# Altium project OVP.PrjPCB
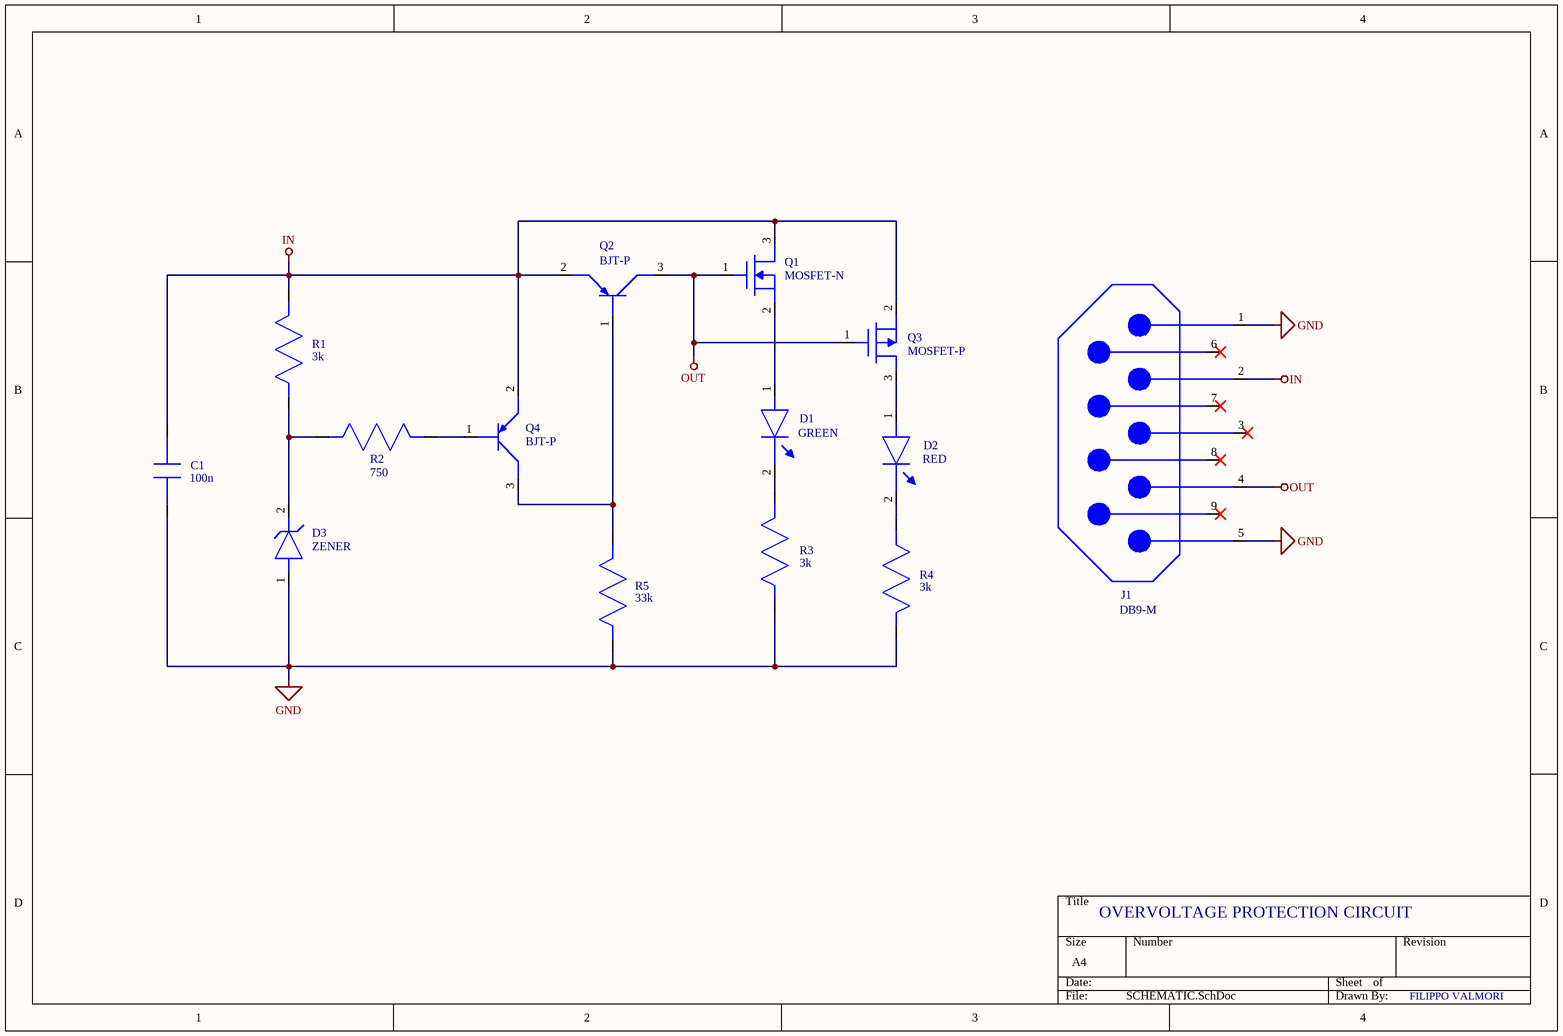
[diagram p0: SCHEMATIC.SchDoc]
1 sheet, 14 parts. Net scope: global (net labels, ports and power ports of the same name join across sheets).
Board file: PCB.PcbDoc

## Sheet SCHEMATIC.SchDoc
size A4

### Parts
C1  100n  [CAP-0603]
D1  GREEN  [LED-0603]
D2  RED  [LED-0603]
D3  ZENER  [ZENER-SOD523]
J1  DB9-M  [DB9]
Q1  MOSFET-N  [NMOS-SOT23]
Q2  BJT-P  [BJT-SOT23]
Q3  MOSFET-P  [PMOS-SOT23]
Q4  BJT-P  [BJT-SOT23]
R1  3k  [RES-0805]
R2  750  [RES-0805]
R3  3k  [RES-0805]
R4  3k  [RES-0805]
R5  33k  [RES-0805]

### Nets
GND: C1.2 D3.1 J1.1 J1.5 R3.1 R4.2 R5.1
IN: C1.1 J1.2 Q1.3 Q2.2 Q3.2 Q4.2 R1.2
OUT: J1.4 Q1.1 Q2.3 Q3.1
NetD1_1: D1.1 Q1.2
NetD1_2: D1.2 R3.2
NetD2_1: D2.1 Q3.3
NetD2_2: D2.2 R4.1
NetD3_2: D3.2 R1.1 R2.1
NetQ2_1: Q2.1 Q4.3 R5.2
NetQ4_1: Q4.1 R2.2

Not connected (* = marked no-connect by the designer): J1 3* 6* 7* 8* 9*

### Notes on the sheet
- OVERVOLTAGE PROTECTION CIRCUIT
- FILIPPO VALMORI

### Library data of the parts
C1 = C0603C104M3RACTU: Multilayer Ceramic Capacitors MLCC - SMD/SMT 25volts 0.1uF X7R 20%; Manufacturer: KEMET; Capacitance: 100nF; Voltage Rating: 25V; Supplier 1: Digi-Key; Manufacturer Part Number: C0603C104M3RACTU; Stock 1: 15620; Pricing 1: 1=0.1, 10=0.06, 100=0.0267, 500=0.01906, 1000=0.01497 (USD); Mount: Surface Mount,PCB; Case/Package: 0603; Number of Pins: 2; Case Code (Metric): 1608; Case Code (Imperial): 0603; Dielectric Material: Ceramic; Min Operating Temperature: -55°C; Max Operating Temperature: 125°C; Packaging: Tape and Reel; Tolerance: 20%; Package Quantity: 1; Voltage Rating (DC): 25V; Dielectric: X7R; Termination: SMD/SMT; Length: 1.6mm; Height: 0.8mm; Width: 0.031inch; Thickness: 0.034inch; Lead Pitch: 0.7mm; Depth: 0.8mm; Radiation Hardening: No; REACH SVHC: No SVHC; ComponentLink1URL: https://www.verical.com/server-webapp/html/getDatasheet?partID=58462&src-supplier=Verical; ComponentLink1Description: https://www.verical.com/server-webapp/html/getDatasheet?partID=58462&src-supplier=Verical; ComponentLink2URL: http://www.farnell.com/datasheets/2746054.pdf?src-supplier=Newark; ComponentLink2Description: http://www.farnell.com/datasheets/2746054.pdf?src-supplier=Newark; ComponentLink3URL: https://www.verical.com/server-webapp/html/getDatasheet?partID=344365&src-supplier=Verical; ComponentLink3Description: https://www.verical.com/server-webapp/html/getDatasheet?partID=344365&src-supplier=Verical; ComponentLink4URL: http://www.alliedelec.com/m/d/9bfe7773041ffe9d406e68bc7b377fdd.pdf?src-supplier=Allied+Electronics; ComponentLink4Description: http://www.alliedelec.com/m/d/9bfe7773041ffe9d406e68bc7b377fdd.pdf?src-supplier=Allied+Electronics; Supplier Part Number 1: 399-1283-6-ND; Category: Capacitors
D1 = 598-8070-107F: DIALIGHT - 5988070107F - LED, Green, SMD, 0603, 20 mA, 2 V, 570 nm; Lens Color: Colorless,Clear; Forward Voltage: 2V; Forward Current: 20mA; Wavelength: 570nm; Luminous Intensity: 20mcd; Viewing Angle: 140°; Lens Style: Flat,Rectangular,Diffused,Colorless,Clear; Dominant Wavelength: 568nm; Number of Elements: 1; Power Dissipation: 60mW; Reverse Voltage: 5V; Lens Transparency: Clear; Lens Size: 0.8mm; Supplier 1: Digi-Key; Manufacturer: Dialight; Manufacturer Part Number: 598-8070-107F; Stock 1: 4673; Pricing 1: 1=0.42, 10=0.3, 100=0.1333, 500=0.09332, 1000=0.07666 (USD); Mount: Surface Mount; Case/Package: 0603; Number of Pins: 2; Color: Green; Case Code (Metric): 1608; Case Code (Imperial): 0603; Min Operating Temperature: -30°C; Max Operating Temperature: 100°C; Package Quantity: 4000; Packaging: Tape and Reel; Illumination Color: Green; Test Current: 20mA; Number of LEDs: 1; Length: 1.6mm; Height: 0.7mm; Depth: 0.8mm; Width: 0.8mm; Radiation Hardening: No; Lead Free: Lead Free; REACH SVHC: No SVHC; ComponentLink1URL: http://www.mouser.com/ds/2/109/SMT_selector_guide-267443.pdf?src-supplier=Mouser; ComponentLink1Description: http://www.mouser.com/ds/2/109/SMT_selector_guide-267443.pdf?src-supplier=Mouser; ComponentLink2URL: http://uk.rs-online.com/webdocs/0ae2/0900766b80ae2975.pdf?src-supplier=RSComponents; ComponentLink2Description: http://uk.rs-online.com/webdocs/0ae2/0900766b80ae2975.pdf?src-supplier=RSComponents; ComponentLink3URL: http://www.farnell.com/datasheets/1720200.pdf?src-supplier=Element14; ComponentLink3Description: http://www.farnell.com/datasheets/1720200.pdf?src-supplier=Element14; ComponentLink4URL: https://media.digikey.com/pdf/Data%20Sheets/Dialight%20PDFs/598_Series_0603_Pkg.pdf?src-supplier=Digi-Key; ComponentLink4Description: https://media.digikey.com/pdf/Data%20Sheets/Dialight%20PDFs/598_Series_0603_Pkg.pdf?src-supplier=Digi-Key; ComponentLink5URL: https://www.alliedelec.com/m/d/745256ca487aea7b70ea31e2d673d5bb.pdf?src-supplier=Allied+Electronics; ComponentLink5Description: https://www.alliedelec.com/m/d/745256ca487aea7b70ea31e2d673d5bb.pdf?src-supplier=Allied+Electronics; ComponentLink6URL: http://www.onlinecomponents.com/productFiles/mf-DIA/mdei5980603.pdf?src-supplier=Onlinecomponents.com; ComponentLink6Description: http://www.onlinecomponents.com/productFiles/mf-DIA/mdei5980603.pdf?src-supplier=Onlinecomponents.com; ComponentLink7URL: https://www.verical.com/server-webapp/html/getDatasheet?partID=146438&src-supplier=Verical; ComponentLink7Description: https://www.verical.com/server-webapp/html/getDatasheet?partID=146438&src-supplier=Verical; ComponentLink8URL: http://www.dialight.com/Assets/Brochures_And_Catalogs/Indication/SMT_selector_guide.pdf?src-supplier=Future+Electronics; ComponentLink8Description: http://www.dialight.com/Assets/Brochures_And_Catalogs/Indication/SMT_selector_guide.pdf?src-supplier=Future+Electronics; Category: Diodes; Supplier Part Number 1: 350-2035-6-ND
D2 = 598-8020-107F: DIALIGHT   5988020107F   LED, RED ORANGE, 150MCD, 630NM; Color: Red,Orange; Lens Color: Colorless,Clear; Forward Current: 20mA; Forward Voltage: 2V; Viewing Angle: 140°; Lens Style: Flat,Diffused,Colorless,Rectangular,Clear; Dominant Wavelength: 625nm; Number of Elements: 1; Power Dissipation: 55mW; Reverse Voltage: 5V; Lens Transparency: Clear; Lens Size: 0.8mm; Supplier 1: Digi-Key; Manufacturer: Dialight; Manufacturer Part Number: 598-8020-107F; Stock 1: 14692; Pricing 1: 1=0.47, 10=0.336, 100=0.1495, 500=0.10464, 1000=0.08595 (USD); Mount: Surface Mount; Case/Package: 0603; Number of Pins: 2; Case Code (Metric): 1608; Case Code (Imperial): 0603; Min Operating Temperature: -30°C; Max Operating Temperature: 100°C; Package Quantity: 4000; Packaging: Tape and Reel; Wavelength: 630nm; Luminous Intensity: 150mcd; Illumination Color: Orange; Test Current: 20mA; Number of LEDs: 1; Length: 1.6mm; Height: 0.7mm; Depth: 0.8mm; Width: 0.8mm; Radiation Hardening: No; Lead Free: Lead Free; REACH SVHC: No SVHC; ComponentLink1URL: https://www.alliedelec.com/m/d/67ce6cfd66c5ca65d1535dac34303b05.pdf?src-supplier=Allied+Electronics; ComponentLink1Description: https://www.alliedelec.com/m/d/67ce6cfd66c5ca65d1535dac34303b05.pdf?src-supplier=Allied+Electronics; ComponentLink2URL: http://www.onlinecomponents.com/productFiles/mf-DIA/mdei5980603.pdf?src-supplier=Onlinecomponents.com; ComponentLink2Description: http://www.onlinecomponents.com/productFiles/mf-DIA/mdei5980603.pdf?src-supplier=Onlinecomponents.com; ComponentLink3URL: https://media.digikey.com/pdf/Data%20Sheets/Dialight%20PDFs/598_Series_0603_Pkg.pdf?src-supplier=Digi-Key; ComponentLink3Description: https://media.digikey.com/pdf/Data%20Sheets/Dialight%20PDFs/598_Series_0603_Pkg.pdf?src-supplier=Digi-Key; ComponentLink4URL: https://www.verical.com/server-webapp/html/getDatasheet?partID=187920&src-supplier=Verical; ComponentLink4Description: https://www.verical.com/server-webapp/html/getDatasheet?partID=187920&src-supplier=Verical; ComponentLink5URL: http://www.farnell.com/datasheets/25658.pdf?src-supplier=Element14; ComponentLink5Description: http://www.farnell.com/datasheets/25658.pdf?src-supplier=Element14; ComponentLink6URL: http://www.dialight.com/Assets/Brochures_And_Catalogs/Indication/SMT_selector_guide.pdf?src-supplier=Future+Electronics; ComponentLink6Description: http://www.dialight.com/Assets/Brochures_And_Catalogs/Indication/SMT_selector_guide.pdf?src-supplier=Future+Electronics; Category: Diodes; Supplier Part Number 1: 350-2030-6-ND
D3 = BZT585B10T-7: DIODE ZENER 10V 350MW SOD523; Manufacturer: Diodes; Impedance: 10R; Tolerance: 2%; Element Configuration: Single; Zener Current: 5mA; Peak Reverse Current: 200nA; Forward Voltage: 900mV; ESD Protection: No; Supplier 1: Digi-Key; Manufacturer Part Number: BZT585B10T-7; Stock 1: 3462; Pricing 1: 1=0.22, 10=0.177, 25=0.148, 100=0.0724, 250=0.07128, 500=0.0604, 1000=0.04197 (USD); Mount: Surface Mount; Case/Package: SOD-523-2; Number of Pins: 2; Weight: 3.5E-05oz; Contact Plating: Tin,Matte; Min Operating Temperature: -65°C; Max Operating Temperature: 150°C; Packaging: Tape and Reel; Zener Voltage: 10V; Max Power Dissipation: 350mW; Voltage Tolerance: 2%; Package Quantity: 3000; Max Reverse Leakage Current: 200nA; Test Current: 5mA; ComponentLink1URL: http://www.mouser.com/ds/2/115/BZT585BxVxT-318149.pdf?src-supplier=Mouser; ComponentLink1Description: http://www.mouser.com/ds/2/115/BZT585BxVxT-318149.pdf?src-supplier=Mouser; ComponentLink2URL: http://diodes.com/datasheets/BZT585BxVxT.pdf?src-supplier=Avnet; ComponentLink2Description: http://diodes.com/datasheets/BZT585BxVxT.pdf?src-supplier=Avnet; ComponentLink3URL: https://www.diodes.com/assets/Datasheets/BZT585BxVxT.pdf?src-supplier=Digi-Key; ComponentLink3Description: https://www.diodes.com/assets/Datasheets/BZT585BxVxT.pdf?src-supplier=Digi-Key; Supplier Part Number 1: BZT585B10T-7DIDKR-ND; Category: Diodes
J1 = 09661227801: D-Sub Standard Connectors DSUB SV ML SSDP ANG73-254 09P AU3; Manufacturer: HARTING Technology; Connector Type: D-Sub,Plug,Signal; Number of Positions: 9; Number of Ports: 1; Current Rating: 7.5A; Supplier 1: Digi-Key; Manufacturer Part Number: 09661227801; Stock 1: 102; Pricing 1: 1=4.15, 10=3.984, 25=3.652, 50=3.486, 100=3.32, 250=2.905, 500=2.822, 1000=2.407 (USD); Mount: Through Hole; Number of Terminals: 9; Housing Material: Polybutylene; Contact Material: Copper Alloy; Min Operating Temperature: -55°C; Max Operating Temperature: 125°C; Package Quantity: 100; Packaging: Bulk; Number of Rows: 2; Termination: Solder; Orientation: Right Angle; Length: 30.9mm; Flammability Rating: UL94 V-0; ComponentLink1URL: https://b2b.harting.com/files/download/PRD/PDF_TS/0966122X80X_BL01_R29733_100202197DRW002A.PDF?src-supplier=Digi-Key; ComponentLink1Description: https://b2b.harting.com/files/download/PRD/PDF_TS/0966122X80X_BL01_R29733_100202197DRW002A.PDF?src-supplier=Digi-Key; Supplier Part Number 1: 1195-4989-ND; Category: Connectors
Q1 = 2N7002LT1G: Trans MOSFET N-CH 60V 0.115A 3-Pin SOT-23 T/R; Manufacturer: ON Semiconductor; Continuous Drain Current (ID): 115mA; Turn-Off Delay Time: 40ns; Turn-On Delay Time: 20ns; Gate to Source Voltage (Vgs): 20V; Rds On Max: 7.5R; Input Capacitance: 50pF; Nominal Vgs: 2.5V; Number of Elements: 1; Max Power Dissipation: 225mW; Power Dissipation: 300mW; Element Configuration: Single; Supplier 1: Digi-Key; Manufacturer Part Number: 2N7002LT1G; Stock 1: 1300580; Pricing 1: 1=0.18, 10=0.164, 25=0.1564, 100=0.0688, 250=0.066, 500=0.054, 1000=0.0375 (USD); Case/Package: SOT-23-3; Number of Pins: 3; Contact Plating: Tin,Matte; Min Operating Temperature: -55°C; Max Operating Temperature: 150°C; Package Quantity: 1; Packaging: Tape and Reel; Drain to Source Voltage (Vdss): 60V; Drain to Source Breakdown Voltage: 60V; Drain to Source Resistance: 7.5R; Threshold Voltage: 2.5V; Voltage Rating (DC): 60V; Current Rating: 115mA; On-State Resistance: 7.5R; Number of Channels: 1; Length: 3.04mm; Height: 1.01mm; Width: 1.4mm; Radiation Hardening: No; REACH SVHC: No SVHC; Lead Free: Lead Free; Halogen Free: Halogen Free; ComponentLink1URL: http://www.onsemi.com/pub/Collateral/2N7002L-D.PDF?src-supplier=Digi-Key; ComponentLink1Description: http://www.onsemi.com/pub/Collateral/2N7002L-D.PDF?src-supplier=Digi-Key; ComponentLink2URL: http://www.farnell.com/datasheets/1747988.pdf?src-supplier=Element14; ComponentLink2Description: http://www.farnell.com/datasheets/1747988.pdf?src-supplier=Element14; ComponentLink3URL: http://www.farnell.com/datasheets/1747988.pdf?src-supplier=Newark; ComponentLink3Description: http://www.farnell.com/datasheets/1747988.pdf?src-supplier=Newark; ComponentLink4URL: http://www.farnell.com/datasheets/2354034.pdf?src-supplier=Element14; ComponentLink4Description: http://www.farnell.com/datasheets/2354034.pdf?src-supplier=Element14; ComponentLink5URL: http://www.onsemi.com/pub_link/Collateral/2N7002L-D.PDF?src-supplier=Future+Electronics; ComponentLink5Description: http://www.onsemi.com/pub_link/Collateral/2N7002L-D.PDF?src-supplier=Future+Electronics; ComponentLink6URL: http://www.onsemi.com/pub/Collateral/2N7002L-D.PDF?src-supplier=Avnet; ComponentLink6Description: http://www.onsemi.com/pub/Collateral/2N7002L-D.PDF?src-supplier=Avnet; ComponentLink7URL: http://www.onsemi.com/pub/Collateral/2N7002L-D.PDF?src-supplier=Avnet+Europe; ComponentLink7Description: http://www.onsemi.com/pub/Collateral/2N7002L-D.PDF?src-supplier=Avnet+Europe; ComponentLink8URL: http://www.onsemi.com/pub/Collateral/2N7002L-D.PDF?src-supplier=Avnet+Asia; ComponentLink8Description: http://www.onsemi.com/pub/Collateral/2N7002L-D.PDF?src-supplier=Avnet+Asia; Category: Transistors; Supplier Part Number 1: 2N7002LT1GOSDKR-ND
Q2 Q4 = MMBT2907ALT1G: MMBT2907AL Series 60 V 600 mA SMT PNP General Purpose Transistor - SOT-23; Manufacturer: ON Semiconductor; Max Power Dissipation: 300mW; Number of Elements: 1; Frequency: 200MHz; Collector Emitter Voltage (VCEO): 60V; hFE Min: 75; Max Collector Current: 600mA; Collector Emitter Breakdown Voltage: -60V; Emitter Base Voltage (VEBO): 5V; Collector Emitter Saturation Voltage: -1.6V; Element Configuration: Single; Current Rating: -600mA; Supplier 1: Digi-Key; Manufacturer Part Number: MMBT2907ALT1G; Stock 1: 211221; Pricing 1: 1=0.15, 10=0.134, 25=0.1276, 100=0.0561, 250=0.05384, 500=0.04406, 1000=0.0306 (USD); Case/Package: SOT-23-3; Number of Pins: 3; Contact Plating: Tin,Matte; Min Operating Temperature: -55°C; Max Operating Temperature: 150°C; Package Quantity: 3000; Packaging: Tape and Reel; Transition Frequency: 200MHz; Max Breakdown Voltage: 60V; Polarity: PNP; Collector Base Voltage (VCBO): 60V; Power Dissipation: 300mW; Gain Bandwidth Product: 200MHz; Max Frequency: 200MHz; Voltage Rating (DC): -60V; Type: General Purpose; Length: 2.9mm; Height: 0.94mm; Width: 1.3mm; Radiation Hardening: No; Lead Free: Lead Free; REACH SVHC: No SVHC; ComponentLink1URL: http://www.onsemi.com/pub/Collateral/MMBT2907ALT1-D.PDF?src-supplier=Digi-Key; ComponentLink1Description: http://www.onsemi.com/pub/Collateral/MMBT2907ALT1-D.PDF?src-supplier=Digi-Key; ComponentLink2URL: https://www.alliedelec.com/m/d/f1da87220e07dfe91b55a9a93f81e6fa.pdf?src-supplier=Allied+Electronics; ComponentLink2Description: https://www.alliedelec.com/m/d/f1da87220e07dfe91b55a9a93f81e6fa.pdf?src-supplier=Allied+Electronics; ComponentLink3URL: http://www.farnell.com/datasheets/2028683.pdf?src-supplier=Farnell; ComponentLink3Description: http://www.farnell.com/datasheets/2028683.pdf?src-supplier=Farnell; ComponentLink4URL: http://www.onsemi.com/pub/Collateral/MMBT2907ALT1-D.PDF?src-supplier=Element14; ComponentLink4Description: http://www.onsemi.com/pub/Collateral/MMBT2907ALT1-D.PDF?src-supplier=Element14; ComponentLink5URL: http://www.onsemi.com/pub/Collateral/MMBT2907ALT1-D.PDF?src-supplier=Future+Electronics; ComponentLink5Description: http://www.onsemi.com/pub/Collateral/MMBT2907ALT1-D.PDF?src-supplier=Future+Electronics; ComponentLink6URL: http://www.onsemi.com/pub/Collateral/MMBT2907ALT1-D.PDF?src-supplier=Avnet; ComponentLink6Description: http://www.onsemi.com/pub/Collateral/MMBT2907ALT1-D.PDF?src-supplier=Avnet; ComponentLink7URL: http://www.farnell.com/datasheets/1744610.pdf?src-supplier=Element14; ComponentLink7Description: http://www.farnell.com/datasheets/1744610.pdf?src-supplier=Element14; ComponentLink8URL: http://www.farnell.com/datasheets/2028683.pdf?src-supplier=Element14; ComponentLink8Description: http://www.farnell.com/datasheets/2028683.pdf?src-supplier=Element14; ComponentLink9URL: https://www.verical.com/server-webapp/html/getDatasheet?partID=44366&src-supplier=Verical; ComponentLink9Description: https://www.verical.com/server-webapp/html/getDatasheet?partID=44366&src-supplier=Verical; Category: Transistors; Supplier Part Number 1: MMBT2907ALT1GOSCT-ND
Q3 = TP0610K-T1-E3: MOSFET P-CH 60V 185MA SOT23-3; Manufacturer: Vishay; Max Power Dissipation: 350mW; Number of Elements: 1; Nominal Vgs: -3V; Rds On Max: 6R; Input Capacitance: 23pF; Drain to Source Resistance: 10R; Gate to Source Voltage (Vgs): 20V; Turn-On Delay Time: 20ns; Element Configuration: Single; Drain to Source Breakdown Voltage: -60V; Supplier 1: Digi-Key; Manufacturer Part Number: TP0610K-T1-E3; Stock 1: 130184; Pricing 1: 1=0.39, 10=0.313, 25=0.2868, 100=0.1801, 250=0.17808, 500=0.16676, 1000=0.11339 (USD); Mount: Surface Mount; Case/Package: TO-236; Number of Pins: 3; Weight: 0.050717oz; Min Operating Temperature: -55°C; Max Operating Temperature: 150°C; Packaging: Tape and Reel; Package Quantity: 1; Drain to Source Voltage (Vdss): 60V; Continuous Drain Current (ID): 185mA; Power Dissipation: 350mW; Threshold Voltage: -3V; Number of Channels: 1; On-State Resistance: 10R; Length: 3.04mm; Height: 1.02mm; Width: 1.4mm; Radiation Hardening: No; REACH SVHC: Unknown; Lead Free: Lead Free; ComponentLink1URL: https://www.verical.com/server-webapp/html/getDatasheet?partID=110418&src-supplier=Verical; ComponentLink1Description: https://www.verical.com/server-webapp/html/getDatasheet?partID=110418&src-supplier=Verical; ComponentLink2URL: http://www.farnell.com/datasheets/2049195.pdf?src-supplier=Newark; ComponentLink2Description: http://www.farnell.com/datasheets/2049195.pdf?src-supplier=Newark; ComponentLink3URL: https://www.alliedelec.com/m/d/8f71ef69d286bdc1948cb77e0f9cb5b1.pdf?src-supplier=Allied+Electronics; ComponentLink3Description: https://www.alliedelec.com/m/d/8f71ef69d286bdc1948cb77e0f9cb5b1.pdf?src-supplier=Allied+Electronics; ComponentLink4URL: http://www.vishay.com/docs/71411/tp0610k.pdf?src-supplier=Avnet+Europe; ComponentLink4Description: http://www.vishay.com/docs/71411/tp0610k.pdf?src-supplier=Avnet+Europe; ComponentLink5URL: http://www.farnell.com/datasheets/1747937.pdf?src-supplier=Farnell; ComponentLink5Description: http://www.farnell.com/datasheets/1747937.pdf?src-supplier=Farnell; ComponentLink6URL: http://www.farnell.com/datasheets/1747937.pdf?src-supplier=Element14; ComponentLink6Description: http://www.farnell.com/datasheets/1747937.pdf?src-supplier=Element14; ComponentLink7URL: http://www.vishay.com/docs/71411/tp0610k.pdf?src-supplier=Avnet; ComponentLink7Description: http://www.vishay.com/docs/71411/tp0610k.pdf?src-supplier=Avnet; ComponentLink8URL: http://www.farnell.com/datasheets/2049195.pdf?src-supplier=Element14; ComponentLink8Description: http://www.farnell.com/datasheets/2049195.pdf?src-supplier=Element14; ComponentLink9URL: http://www.vishay.com/docs/71411/tp0610k.pdf?src-supplier=Digi-Key; ComponentLink9Description: http://www.vishay.com/docs/71411/tp0610k.pdf?src-supplier=Digi-Key; ComponentLink10URL: http://datasheet.iiic.cc/vishay_[siliconix]/TP0610K-T1-E3.pdf?src-supplier=IIIC; ComponentLink10Description: http://datasheet.iiic.cc/vishay_[siliconix]/TP0610K-T1-E3.pdf?src-supplier=IIIC; Category: Transistors; Supplier Part Number 1: TP0610K-T1-E3DKR-ND
R1 R3 R4 = RNCP0805FTD3K01: RES SMD 3.01K OHM 1% 1/4W 0805; Manufacturer: Stackpole Electronics; Resistance: 3.01kR; Max Power Dissipation: 250mW; Temperature Coefficient: 100ppm/°C; Supplier 1: Digi-Key; Manufacturer Part Number: RNCP0805FTD3K01; Stock 1: 3825; Pricing 1: 1=0.1, 10=0.069, 100=0.0264, 1000=0.01162, 2500=0.01003 (USD); Mount: Surface Mount; Case/Package: 0805; Case Code (Metric): 2012; Case Code (Imperial): 0805; Contact Plating: Tin,Matte; Min Operating Temperature: -55°C; Max Operating Temperature: 155°C; Packaging: Tape and Reel; Tolerance: 1%; Composition: Thin Film; Number of Terminations: 2; Features: Moisture Resistant,Anti-Sulfur; Length: 0.079inch; Height: 0.024inch; Width: 0.049inch; Radiation Hardening: No; ComponentLink1URL: http://www.seielect.com/Catalog/SEI-rncp.pdf?src-supplier=Digi-Key; ComponentLink1Description: http://www.seielect.com/Catalog/SEI-rncp.pdf?src-supplier=Digi-Key; ComponentLink2URL: https://www.seielect.com/catalog/SEI-Packaging.pdf?src-supplier=Digi-Key; ComponentLink2Description: https://www.seielect.com/catalog/SEI-Packaging.pdf?src-supplier=Digi-Key; ComponentLink3URL: https://www.seielect.com/Catalog/SEI-rncp.pdf?src-supplier=Avnet; ComponentLink3Description: https://www.seielect.com/Catalog/SEI-rncp.pdf?src-supplier=Avnet; Supplier Part Number 1: RNCP0805FTD3K01DKR-ND; Category: Resistors
R2 = RNCP0805FTD750R: RES SMD 750 OHM 1% 1/4W 0805; Manufacturer: Stackpole Electronics; Resistance: 750R; Max Power Dissipation: 250mW; Temperature Coefficient: 100ppm/°C; Supplier 1: Digi-Key; Manufacturer Part Number: RNCP0805FTD750R; Stock 1: 16430; Pricing 1: 1=0.1, 10=0.072, 100=0.0277, 1000=0.0122, 2500=0.01053 (USD); Mount: Surface Mount; Case/Package: 0805; Case Code (Metric): 2012; Case Code (Imperial): 0805; Contact Plating: Tin,Matte; Min Operating Temperature: -55°C; Max Operating Temperature: 155°C; Tolerance: 1%; Packaging: Tape and Reel; Composition: Thin Film; Number of Terminations: 2; Features: Moisture Resistant,Anti-Sulfur; Length: 0.079inch; Height: 0.024inch; Width: 0.049inch; Radiation Hardening: No; Lead Free: Lead Free; ComponentLink1URL: http://www.seielect.com/Catalog/SEI-rncp.pdf?src-supplier=Digi-Key; ComponentLink1Description: http://www.seielect.com/Catalog/SEI-rncp.pdf?src-supplier=Digi-Key; ComponentLink2URL: https://www.seielect.com/Catalog/SEI-rncp.pdf?src-supplier=Avnet; ComponentLink2Description: https://www.seielect.com/Catalog/SEI-rncp.pdf?src-supplier=Avnet; ComponentLink3URL: https://www.seielect.com/catalog/SEI-Packaging.pdf?src-supplier=Digi-Key; ComponentLink3Description: https://www.seielect.com/catalog/SEI-Packaging.pdf?src-supplier=Digi-Key; Category: Resistors; Supplier Part Number 1: RNCP0805FTD750RDKR-ND
R5 = RNCP0805FTD33K2: RES SMD 33.2K OHM 1% 1/4W 0805; Manufacturer: Stackpole Electronics; Resistance: 33.2kR; Max Power Dissipation: 250mW; Temperature Coefficient: 100ppm/°C; Supplier 1: Digi-Key; Manufacturer Part Number: RNCP0805FTD33K2; Stock 1: 3563; Pricing 1: 1=0.1, 10=0.069, 100=0.0264, 1000=0.01162, 2500=0.01003 (USD); Mount: Surface Mount; Case/Package: 0805; Case Code (Metric): 2012; Case Code (Imperial): 0805; Min Operating Temperature: -55°C; Max Operating Temperature: 155°C; Tolerance: 1%; Packaging: Tape and Reel; Composition: Thin Film; Number of Terminations: 2; Features: Moisture Resistant,Anti-Sulfur; Length: 0.079inch; Height: 0.024inch; Width: 0.049inch; ComponentLink1URL: http://www.seielect.com/Catalog/SEI-rncp.pdf?src-supplier=Digi-Key; ComponentLink1Description: http://www.seielect.com/Catalog/SEI-rncp.pdf?src-supplier=Digi-Key; ComponentLink2URL: https://www.seielect.com/catalog/SEI-Packaging.pdf?src-supplier=Digi-Key; ComponentLink2Description: https://www.seielect.com/catalog/SEI-Packaging.pdf?src-supplier=Digi-Key; Supplier Part Number 1: RNCP0805FTD33K2DKR-ND; Category: Resistors

## Assembly variants
NO LED BRANCHES: not fitted D1 D2 Q1 Q3 R3 R4